# Altium schematic sheet DS157-1.1-C心率传感器.SchDoc
size A4; SheetNumber: 1; SheetTotal: 1
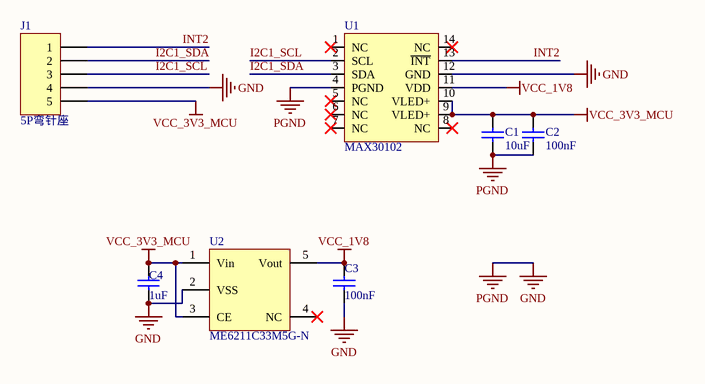
[diagram p0: DS157-1.1-C心率传感器.SchDoc]

## Parts
C1  value 10uF  [0603CAP]  (hidden comment: SMDCAP00016)
C2  value 100nF  [0603CAP]  (hidden comment: SMDCAP00013)
C3  value 100nF  [0603CAP]  (hidden comment: SMDCAP00013)
C4  value 1uF  [0603CAP]  (hidden comment: SMDCAP00015)
J1  value 5P弯针座  [XH2.54-5PW]  (hidden comment: SL000000035)
U1  MAX30102  [OESIP-14]
U2  ME6211C33M5G-N  [SOT23-5]

## Nets
GND: C1.1 C2.2 C3.1 C4.1 J1.4 U1.4(PGND) U1.12(GND) U2.2(VSS)  [also labelled PGND]
VCC_1V8: C3.2 U1.11(VDD) U2.5(Vout)
VCC_3V3_MCU: C1.2 C2.1 C4.2 J1.5 U1.9(VLED+) U1.10(VLED+) U2.1(Vin) U2.3(CE)
I2C1_SCL: J1.3 U1.2(SCL)
I2C1_SDA: J1.2 U1.3(SDA)
INT2: J1.1 U1.13(~{INT})

Not connected (* = marked no-connect by the designer): U1 1(NC)* 5(NC)* 6(NC)* 7(NC)* 8(NC)* 14(NC)*; U2 4(NC)*

## Library data of the parts
C1 = MLCC 10uF 50V ±10％ 0603: 贴片电容
C2 C3 = MLCC 100nF 50V ±10％ 0603: 贴片电容
C4 = MLCC 1uF 50V ±10％ 0603: 贴片电容
J1 = XH2.54mm-5AW 弯针座: 5P弯针座
U2 = ME6211C33M5G-N: 稳压芯片